# EAGLE design tricorder-photodiode-breakout-mk-1.1 (EAGLE 7.5.0)
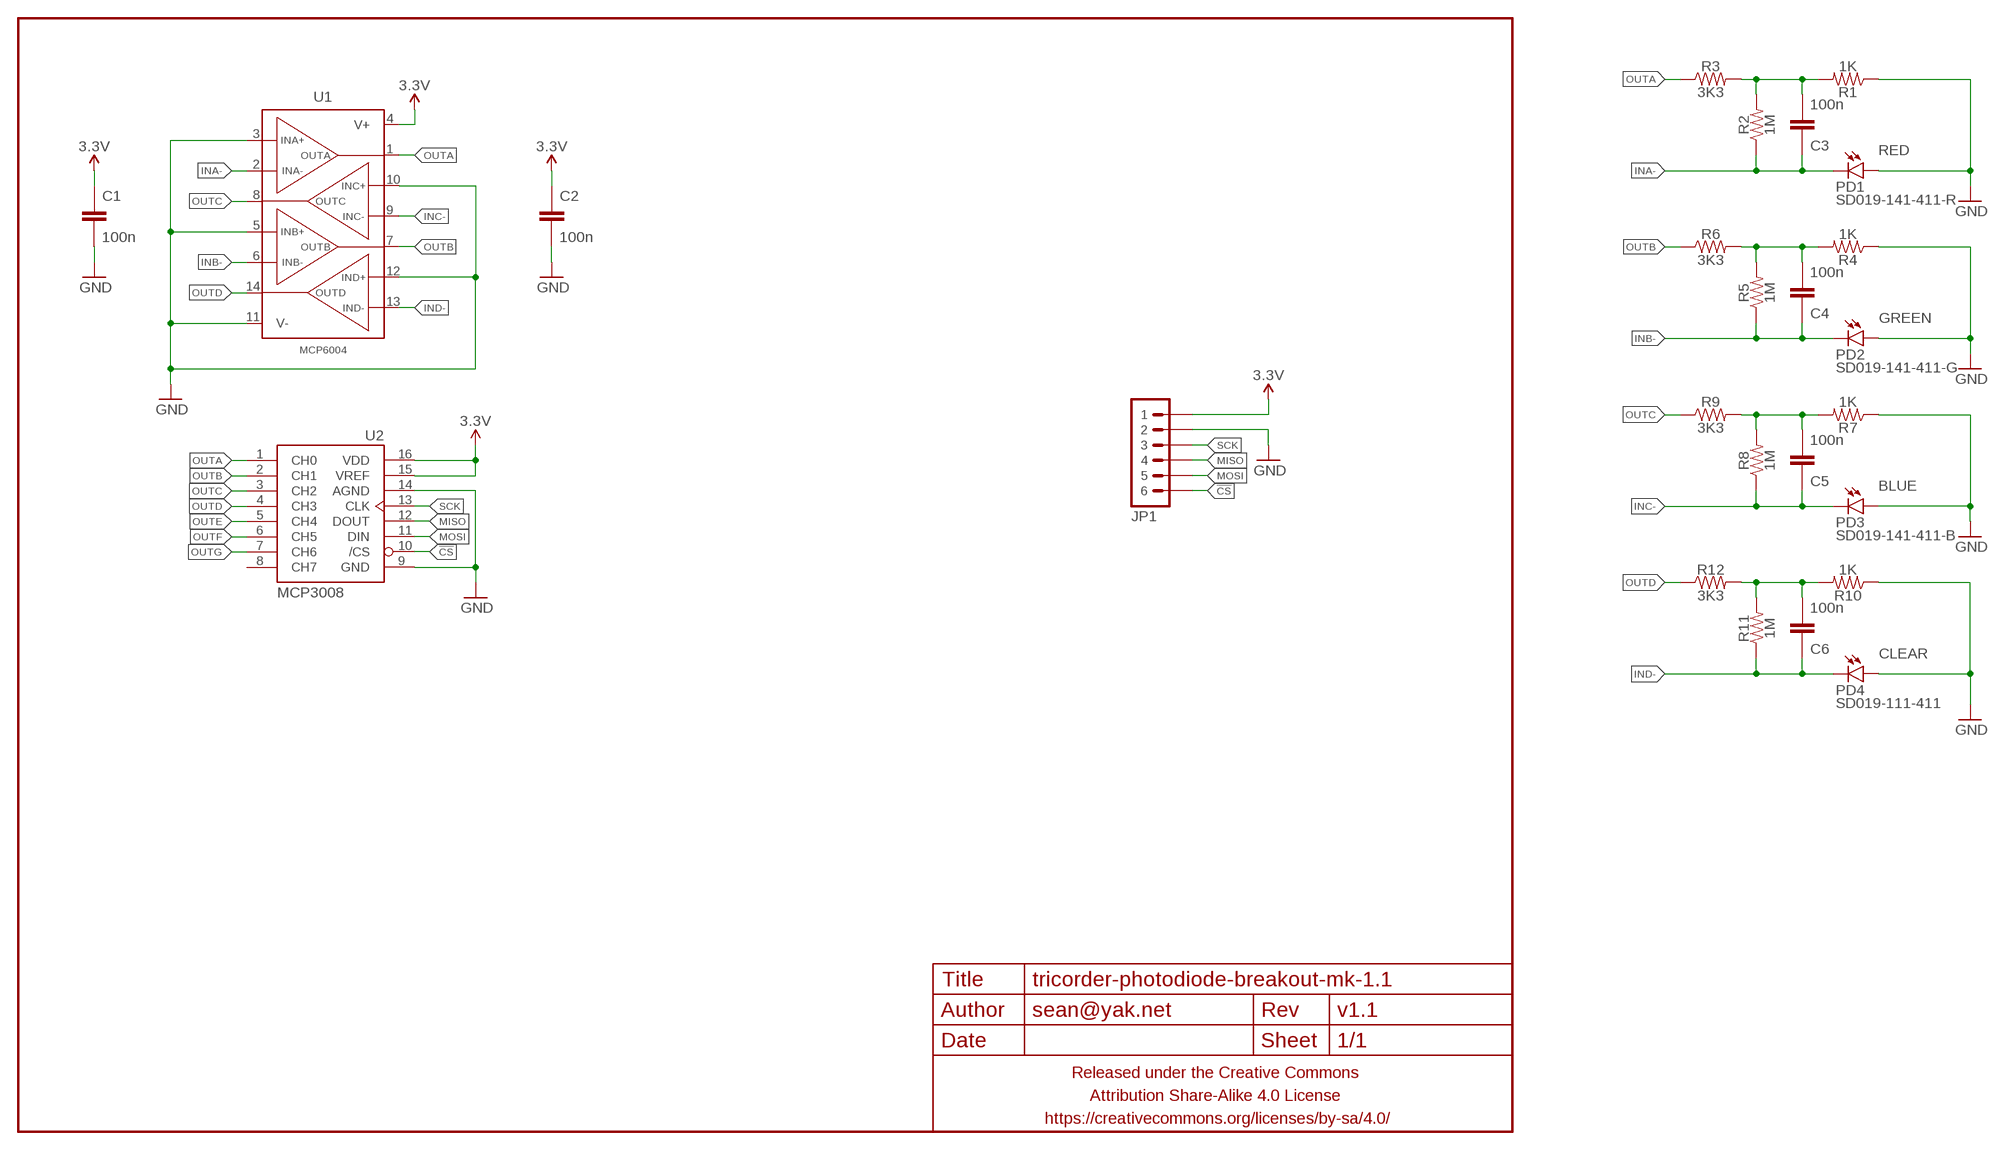
[diagram p0: schematic, sheet 1]

## Parts
C1  100n  CAPACITOR-CERAMICC0603  [C0603]
C2  100n  CAPACITOR-CERAMICC0603  [C0603]
C3  100n  CAPACITOR-CERAMICC0603  [C0603]
C4  100n  CAPACITOR-CERAMICC0603  [C0603]
C5  100n  CAPACITOR-CERAMICC0603  [C0603]
C6  100n  CAPACITOR-CERAMICC0603  [C0603]
FRAME1  FRAME-LETTERNO_PACKAGE  [DUMMY]
JP1  M06JST-PH-PTH-VERT  [JST-6-PH-VERT-PTH]
PD1  SD019-141-411-R  PHOTODIODESMD-0805  [LED-0805]
PD2  SD019-141-411-G  PHOTODIODESMD-0805  [LED-0805]
PD3  SD019-141-411-B  PHOTODIODESMD-0805  [LED-0805]
PD4  SD019-111-411  PHOTODIODESMD-0805  [LED-0805]
R1  1K  RESISTORR0603  [R0603]
R2  1M  RESISTORR0603  [R0603]
R3  3K3  RESISTORR0603  [R0603]
R4  1K  RESISTORR0603  [R0603]
R5  1M  RESISTORR0603  [R0603]
R6  3K3  RESISTORR0603  [R0603]
R7  1K  RESISTORR0603  [R0603]
R8  1M  RESISTORR0603  [R0603]
R9  3K3  RESISTORR0603  [R0603]
R10  1K  RESISTORR0603  [R0603]
R11  1M  RESISTORR0603  [R0603]
R12  3K3  RESISTORR0603  [R0603]
U1  MCP6004  MCP6004SOIC14  [SO14]
U2  MCP3008  MCP3008SOIC16  [SO16]

## Nets
3.3V: C1.1 C2.1 JP1.1 U1.4(V+) U2.15(VREF) U2.16(VDD)
!CS: JP1.6 U2.10(/CS)
GND: C1.2 C2.2 JP1.2 PD1.A PD2.A PD3.A PD4.A R1.1 R4.1 R7.1 R10.1 U1.3(INA+) U1.5(INB+) U1.10(INC+) U1.11(V-) U1.12(IND+) U2.9(GND) U2.14(AGND)
INA-: C3.1 PD1.C R2.1 U1.2(INA-)
INB-: C4.1 PD2.C R5.1 U1.6(INB-)
INC-: C5.1 PD3.C R8.1 U1.9(INC-)
IND-: C6.1 PD4.C R11.1 U1.13(IND-)
MISO: JP1.4 U2.12(DOUT)
MOSI: JP1.5 U2.11(DIN)
N$5: C3.2 R1.2 R2.2 R3.2
N$6: C4.2 R4.2 R5.2 R6.2
N$7: C5.2 R7.2 R8.2 R9.2
N$8: C6.2 R10.2 R11.2 R12.2
OUTA: R3.1 U1.1(OUTA) U2.1(CH0)
OUTB: R6.1 U1.7(OUTB) U2.2(CH1)
OUTC: R9.1 U1.8(OUTC) U2.3(CH2)
OUTD: R12.1 U1.14(OUTD) U2.4(CH3)
OUTE: U2.5(CH4)
OUTF: U2.6(CH5)
OUTG: U2.7(CH6)
SCK: JP1.3 U2.13(CLK)
Unconnected: U2.8(CH7)

## Notes on the sheet
- RED
- GREEN
- BLUE
- CLEAR

## Library data of the parts
C1-C6 = a_parts:CAPACITOR-CERAMIC: CAPACITOR, European symbol
FRAME1 = a_parts:FRAME-LETTER: Schematic Frame Standard 8.5x11 US Letter frame; DESIGNER: sean@yak.net; VERSION: v1.1
JP1 = a_parts:M06: Header 6 Standard 6-pin 0.1" header. Use with straight break away headers (SKU : PRT-00116), right angle break away headers (PRT-00553), swiss pins (PRT-00743), machine pins (PRT-00117), and female headers (PRT-00115). Molex polarized connector foot print use with SKU : PRT-08094 with associated crimp pins and housings. NOTES ON THE VARIANTS LOCK and LOCK_LONGPADS... This footprint was designed to help hold the alignment of a through-hole component (i.e. 6-pin header) while soldering it into place. You may notice that each hole has been shifted either up or down by 0.005 of an inch from it's more standard position (which is a perfectly straight line). This slight alteration caused the pins (the squares in the middle) to touch the edges of the holes. Because they are alternating, it causes a "brace" to hold the component in place. 0.005 has proven to be the perfect amount of "off-center" position when using our standard breakaway headers. Although looks a little odd when you look at the bare footprint, once you have a header in there, the alteration is very hard to notice. Also,if you push a header all the way into place, it is covered up entirely on the bottom side. This idea of altering the position of holes to aid alignment will be further integrated into the Sparkfun Library for other footprints. It can help hold any component with 3 or more connection pins.
PD1-PD4 = a_parts:PHOTODIODE
R1-R12 = a_parts:RESISTOR: RESISTOR, American symbol
U1 = a_parts:MCP6004
U2 = a_parts:MCP3008

## Board
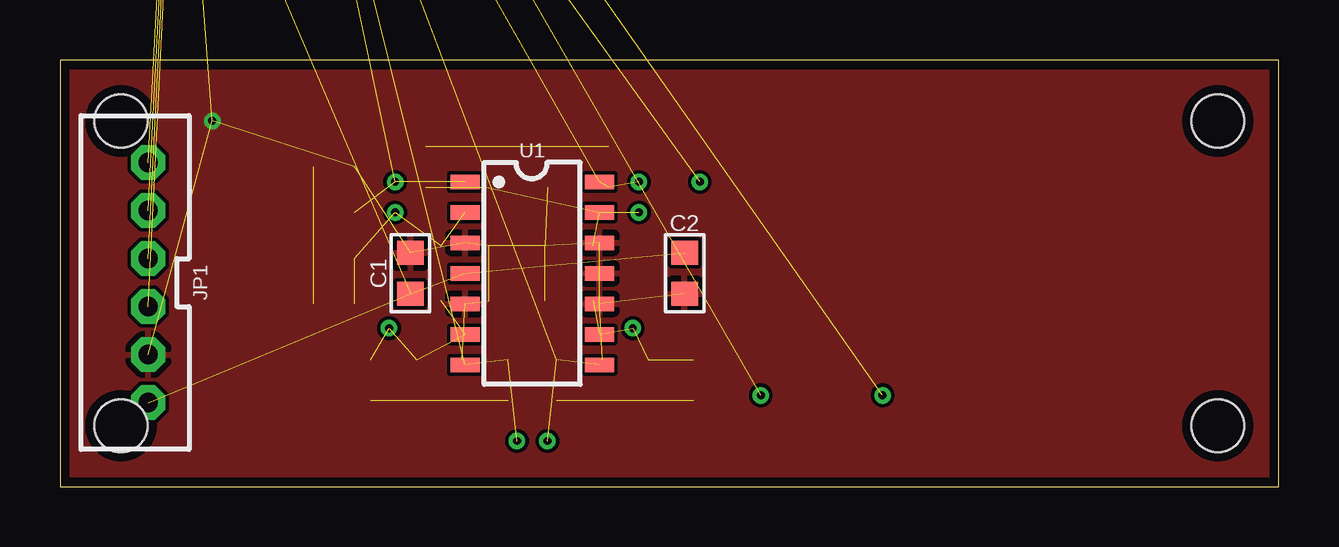
[diagram p1: board, top side]
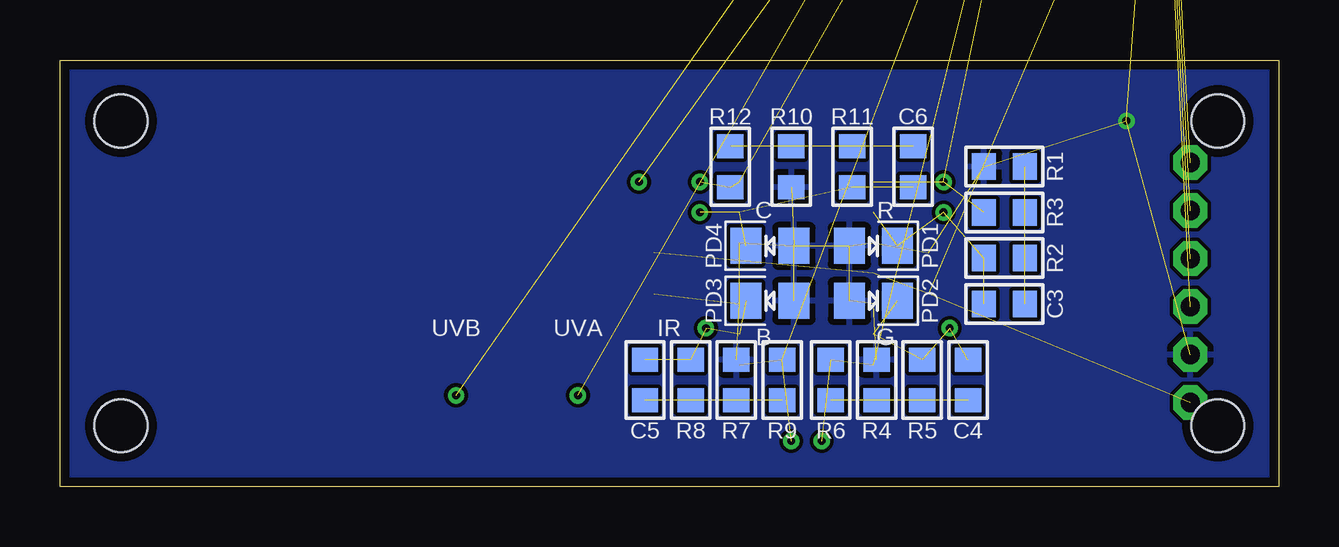
[diagram p2: board, bottom side, seen from below]

Size 50.8 x 17.78 mm. Coordinates in mm from the lower left corner, seen from the top.
Outline: 0,0 50.8,0 50.8,17.78 0,17.78 0,0
Copper layers (1*16): Top 0.0356mm / dielectric 1.5011mm / Bottom 0.0356mm
Design rules "LaenPCBOrder2": minimum track width 6mil, minimum drill 13mil, track to track 6mil, track to pad 6mil, pad to pad 6mil, via to via 6mil, smd to smd 6mil, copper to edge 15mil, drill to drill 6mil, minimum pad ring 7mil, minimum via ring 7mil, stop-mask expansion 3mil, vias tented up to drill 20mil, thermal gap 10mil
Holes 2.2 mm at 2.54,15.24 2.54,2.54 48.26,15.24 48.26,2.54

### Footprints (pad centres in the part's own frame; a part is rotated, then mirrored left to right if it is on the bottom)
C0603 = smd 1 x 1.1: 1 -0.85,0; 2 0.85,0
JST-6-PH-VERT-PTH = drill 0.8 pad 1.422 octagon: 1 -5,0; 2 -3,0; 3 -1,0; 4 1,0; 5 3,0; 6 5,0
LED-0805 = smd 1.5 x 1.3: A 0,-1; C 0,1
R0603 = smd 1 x 1.1: 1 -0.85,0; 2 0.85,0
SO14 = smd 0.6 x 1.2: 1 -3.81,-2.8; 2 -2.54,-2.8; 3 -1.27,-2.8; 4 0,-2.8; 5 1.27,-2.8; 6 2.54,-2.8; 7 3.81,-2.8; 8 3.81,2.8; 9 2.54,2.8; 10 1.27,2.8; 11 0,2.8; 12 -1.27,2.8; 13 -2.54,2.8; 14 -3.81,2.8
SO16 = smd 0.7 x 2: 1 -4.445,-2.6; 2 -3.175,-2.6; 3 -1.905,-2.6; 4 -0.635,-2.6; 5 0.635,-2.6; 6 1.905,-2.6; 7 3.175,-2.6; 8 4.445,-2.6; 9 4.445,2.6; 10 3.175,2.6; 11 1.905,2.6; 12 0.635,2.6; 13 -0.635,2.6; 14 -1.905,2.6; 15 -3.175,2.6; 16 -4.445,2.6

### Placement (x,y rotation side)
C1  14.61,8.89 90 top
C2  26.04,8.89 270 top
C3  11.43,7.62 0 bottom
C4  12.95,4.45 270 bottom
C5  26.42,4.45 270 bottom
C6  15.24,13.34 90 bottom
FRAME1  0,0 0 top
JP1  3.68,8.51 90 top
PD1  16.89,10.03 270 bottom
PD2  16.89,7.75 270 bottom
PD3  21.21,7.75 90 bottom
PD4  21.21,10.03 90 bottom
R1  11.43,13.34 0 bottom
R2  11.43,9.53 0 bottom
R3  11.43,11.43 0 bottom
R4  16.76,4.45 270 bottom
R5  14.86,4.45 270 bottom
R6  18.67,4.45 270 bottom
R7  22.61,4.45 270 bottom
R8  24.51,4.45 270 bottom
R9  20.7,4.45 270 bottom
R10  20.32,13.34 90 bottom
R11  17.78,13.34 90 bottom
R12  22.86,13.34 90 bottom
U1  19.68,8.89 270 top
U2  7.62,34.92 90 top  (outside the outline)

### Tracks (layer width: path | path; a pad name or v marks a point on that pad's centre or on a via)
3.3V  (5 unrouted)
!CS  (1 unrouted)
GND  (via drill 0.33)  (18 unrouted)
  other vias: 6.35,15.24
  pour Bottom: 0,0 50.8,0 50.8,17.78 0,17.78
  pour Top: 0,0 50.8,0 50.8,17.78 0,17.78
INA-  (via drill 0.33)  (4 unrouted)
  other vias: 13.97,11.43
INB-  (via drill 0.33)  (4 unrouted)
  other vias: 13.72,6.6
INC-  (via drill 0.33)  (4 unrouted)
  other vias: 23.88,6.6
IND-  (via drill 0.33)  (4 unrouted)
  other vias: 24.13,11.43
MISO  (1 unrouted)
MOSI  (1 unrouted)
N$5  (3 unrouted)
N$6  (3 unrouted)
N$7  (3 unrouted)
N$8  (3 unrouted)
OUTA  (via drill 0.33)  (3 unrouted)
  other vias: 13.97,12.7
OUTB  (via drill 0.33)  (3 unrouted)
  other vias: 19.05,1.91
OUTC  (via drill 0.33)  (3 unrouted)
  other vias: 20.32,1.91
OUTD  (via drill 0.33)  (3 unrouted)
  other vias: 24.13,12.7
OUTE  (via drill 0.33)  (1 unrouted)
  other vias: 26.67,12.7
OUTF  (via drill 0.33)  (1 unrouted)
  other vias: 29.21,3.81
OUTG  (via drill 0.33)  (1 unrouted)
  other vias: 34.29,3.81
SCK  (1 unrouted)

### Text on the board
bNames: R | C | G | B | IR | UVA | UVB